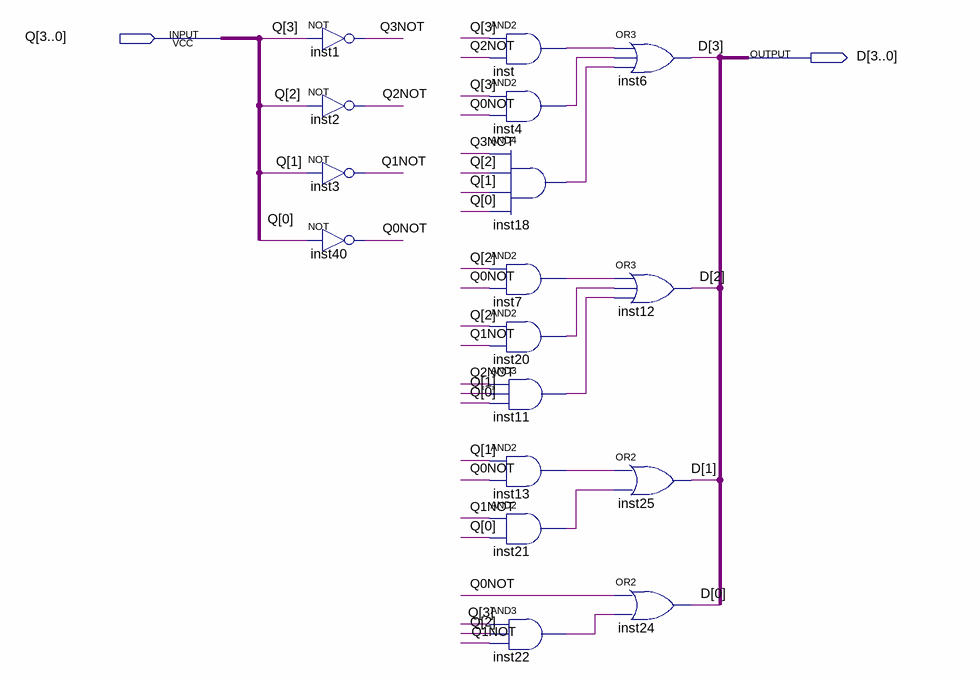
[diagram p0: schematic sheet]
// Quartus schematic TTKT.bdf as structural Verilog: 17 symbols, 2 pins
module TTKT (
  input  [3:0] Q,
  output [3:0] D
);

  wire inst4_out, inst7_out, inst11_out, inst13_out, inst18_out, inst20_out, inst21_out, inst22_out,
       inst_out, Q0NOT, Q1NOT, Q2NOT, Q3NOT;

  not inst1 (Q3NOT, Q[3]);
  not inst2 (Q2NOT, Q[2]);
  not inst3 (Q1NOT, Q[1]);
  not inst40 (Q0NOT, Q[0]);
  and inst (inst_out, Q[3], Q2NOT);
  and inst4 (inst4_out, Q[3], Q0NOT);
  and inst18 (inst18_out, Q3NOT, Q[2], Q[1], Q[0]);
  and inst7 (inst7_out, Q[2], Q0NOT);
  and inst20 (inst20_out, Q[2], Q1NOT);
  and inst11 (inst11_out, Q2NOT, Q[1], Q[0]);
  and inst13 (inst13_out, Q[1], Q0NOT);
  and inst21 (inst21_out, Q1NOT, Q[0]);
  and inst22 (inst22_out, Q[3], Q[2], Q1NOT);
  or inst6 (D[3], inst_out, inst4_out, inst18_out);
  or inst12 (D[2], inst7_out, inst20_out, inst11_out);
  or inst25 (D[1], inst13_out, inst21_out);
  or inst24 (D[0], Q0NOT, inst22_out);
endmodule
